# Altium project LimePSB-RPCM_1v3.PrjPcb (part 4 of 14)
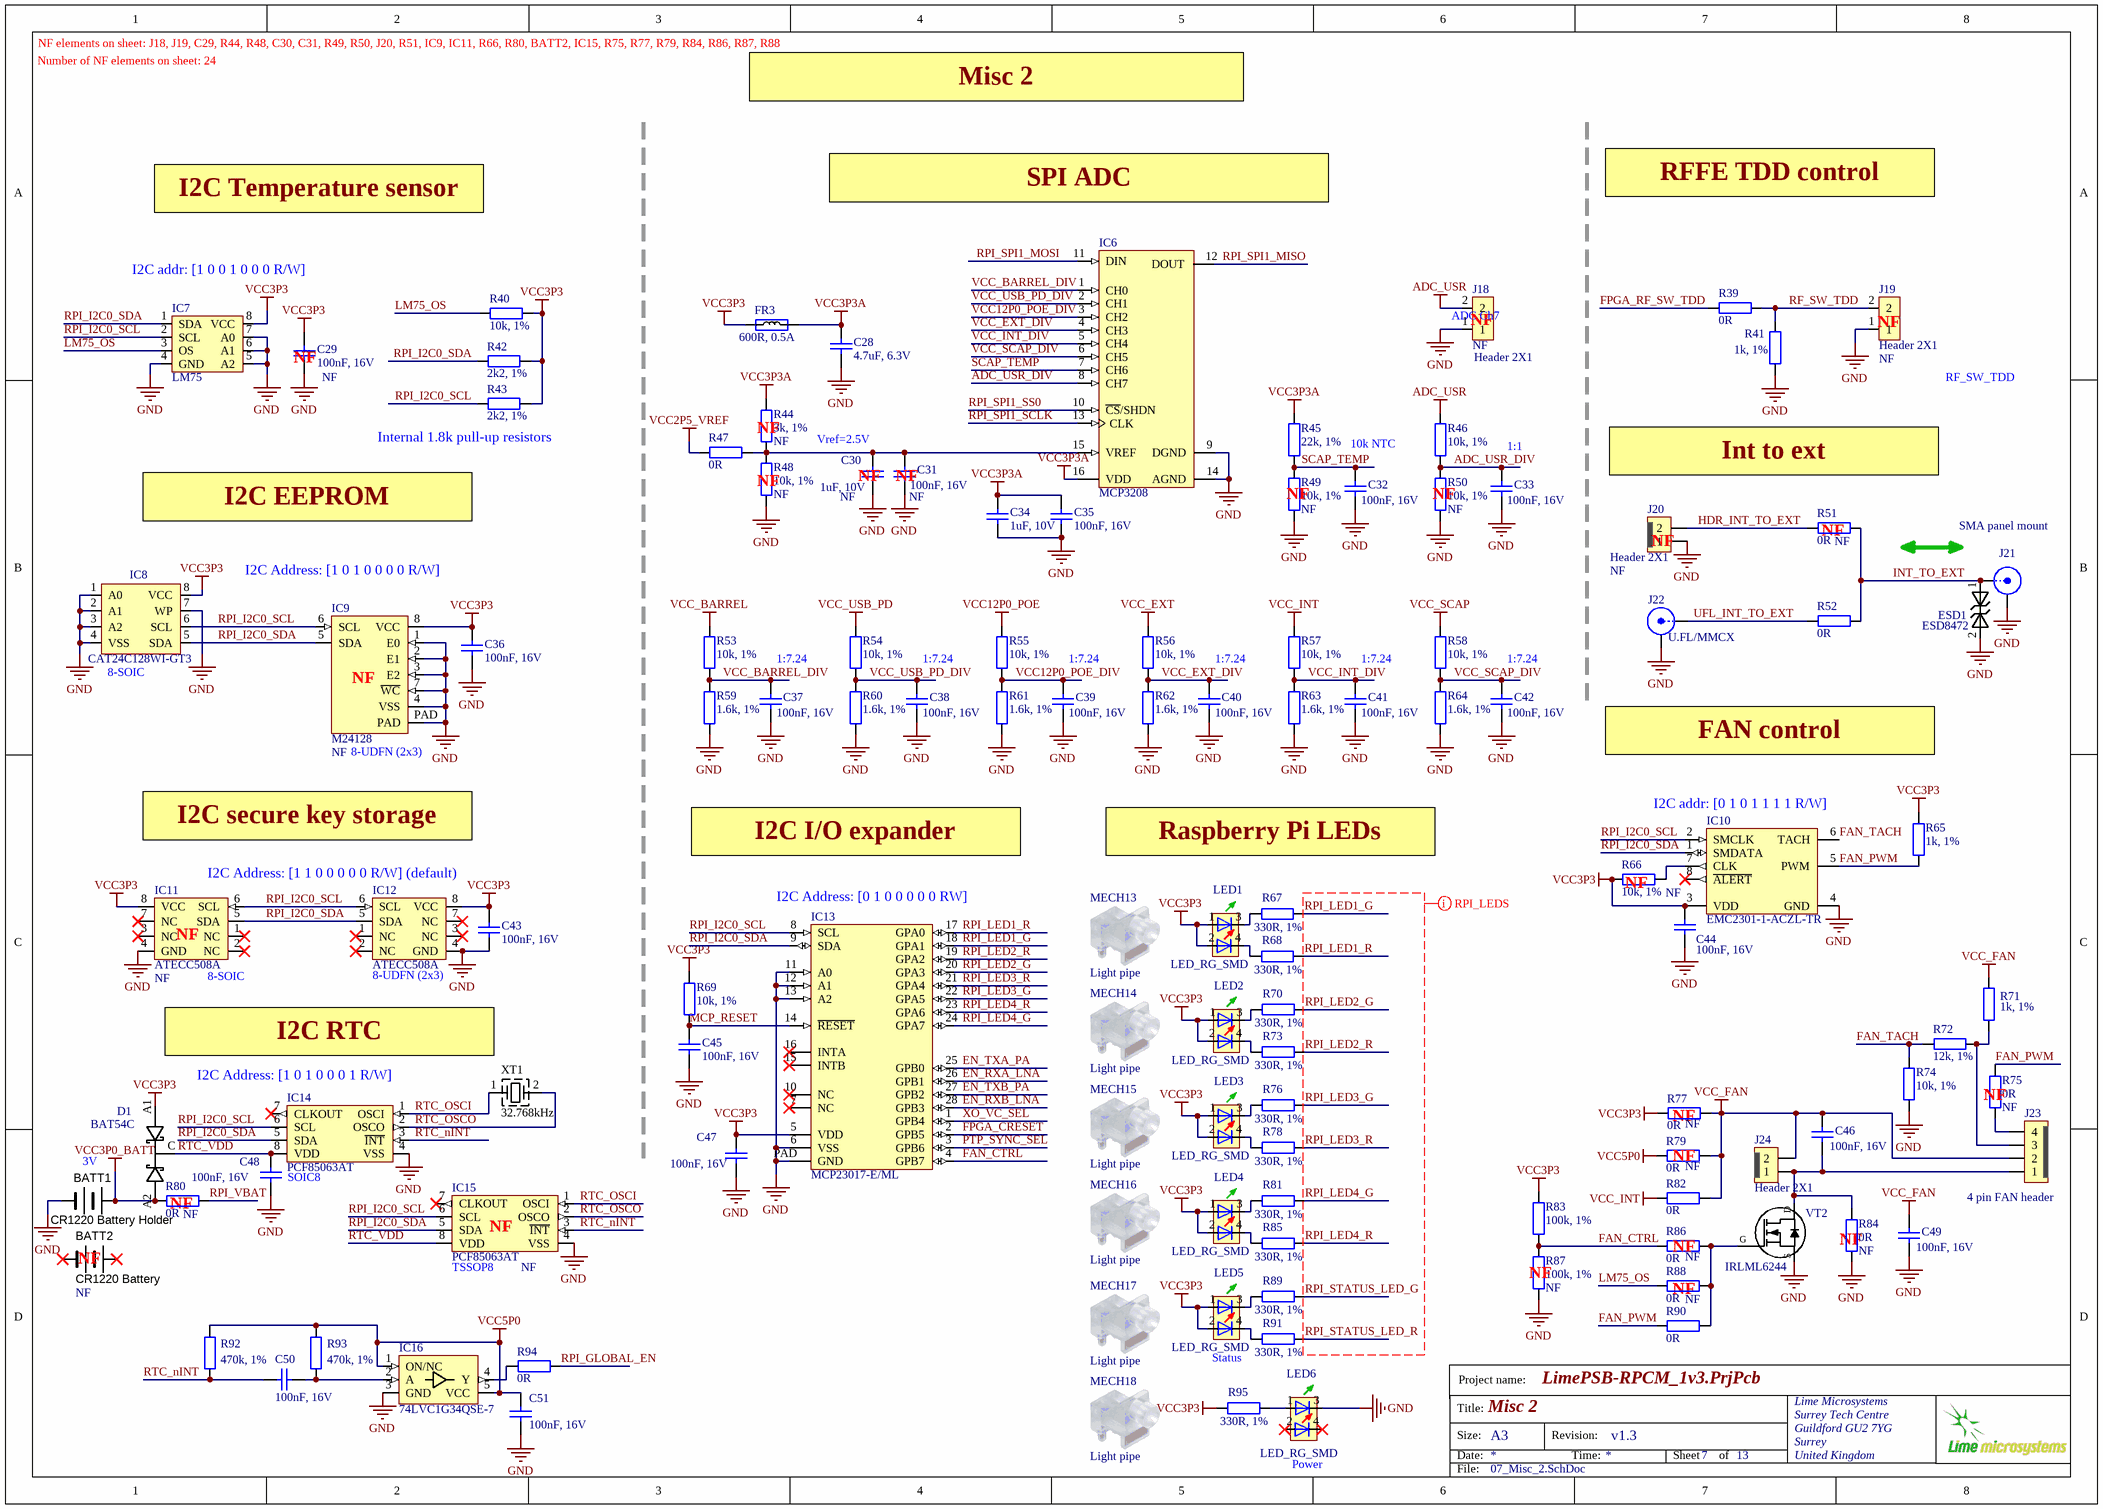
[diagram p108: 07_Misc_2.SchDoc]

## Sheet 07_Misc_2.SchDoc: Misc 2 (continued)

### Library data of the parts
BATT1 = CR1220_BATTERY_HOLDER: Part Description: HOLDER COIN CELL FOR CR1220 SMD; Manufacturer: MPD (Memory Protection Devices); Manufacturer Part Number 1: BC501SM; Battery Type, Function: Coin Cell, Holder; Style: Holder (Open); Battery Cell Size: Coin, 12.0mm; Number of Cells: 1; Battery Series: 1220; Supplier 1: Digi-Key; RoHS: RoHS Compliant; Category: Battery Products; Stock 1: 17830; Pricing 1: 1=0.88, 10=0.81, 100=0.73, 500=0.68, 1000=0.59 (USD); Part Status: Active; Mounting Type: PCB, Surface Mount; Termination Style: SMD (SMT) Tab; Height Above Board: 0.157" (4.00mm); Operating Temperature: -40°C ~ 85°C; ComponentLink1URL: http://www.memoryprotectiondevices.com/datasheets/BC501SM-datasheet.pdf; ComponentLink1Description: http://www.memoryprotectiondevices.com/datasheets/BC501SM-datasheet.pdf; Supplier Part Number 1: BC501SM-ND
BATT2 = CR1220_BATTERY: Part Description: Lithium Battery Non-Rechargeable (Primary) 3V Coin, 12.5mm; Manufacturer: Panasonic - BSG; Battery Chemistry: Lithium; Battery Cell Size: Coin, 12.5mm; Voltage - Rated: 3V; Capacity: 35mAh; Discharge Rate: 100µA; Shipping Info: Due to possible restrictions, a change in ship method may be required.; Max Air Shipment Qty: 1600; Supplier 1: Digi-Key; Manufacturer Part Number 1: CR1220; RoHS: Not Applicable; Category: Battery Products; Stock 1: 19831; Pricing 1: 1=0.9, 10=0.812, 50=0.7214, 100=0.6312, 250=0.57712, 500=0.54106, 1600=0.48153, 3200=0.44651, 5000=0.43775 (USD); Part Status: Active; Size / Dimension: 0.49" Dia x 0.08" H (12.5mm x 2.0mm); Termination Style: Requires Holder; Weight: 1.2g; ComponentLink1URL: http://na.industrial.panasonic.com/sites/default/pidsa/files/crseries_datasheets_merged.pdf; ComponentLink1Description: http://na.industrial.panasonic.com/sites/default/pidsa/files/crseries_datasheets_merged.pdf; Supplier Part Number 1: P033-ND
C28 = Cap_0402: Manufacturer: Murata Electronics North America; Manufacturer Part Number: GRM155R60J475ME87D; Part Description: 4.7µF ±20% 6.3V X5R Ceramic Capacitor -55°C ~ 85°C Surface Mount, MLCC 0402 (1005 Metric) 0.039" L x 0.020" W (1.00mm x 0.50mm); Tolerance: ±20%; Capacitance: 4.7µF; Temperature Coefficient: X5R; Lead Style: -; Ratings: -; Height - Seated (Max): -; Thickness (Max): 0.022" (0.55mm); Voltage - Rated: 6.3V; Packaging: Cut Tape (CT); Lead Spacing: -; Category: Capacitors; Supplier Part Number 1: 490-5408-1-ND; Applications: General Purpose; Operating Temperature: -55°C ~ 85°C; Mounting Type: Surface Mount, MLCC; Features: Derating Recommended; RoHS: RoHS Compliant; Supplier 1: Digi-Key; Package / Case: 0402 (1005 Metric); Size / Dimension: 0.039" L x 0.020" W (1.00mm x 0.50mm); Value: 4.7uF, 6.3V; Manufacturer Part Number 1: GRM155R60J475ME87D
C29 C31-C33 C36-C43 C45-C47 C49 = Cap_0603: Manufacturer Part Number 1: GRM155R71C104KA88D; Part Description: 0.10µF ±10% 16V Ceramic Capacitor X7R 0402 (1005 Metric); Brand: Murata Electronics; Tolerance: 10 %; Type: General Purpose MLCC; Capacitance: 0.1 uF; Temperature Coefficient / Code: +/- 15 %; Case Height: 0.5 mm; Case Length: 1 mm; Dielectric: X7R; Supplier 1: Mouser; Supplier Part Number 1: 81-GRM155R71C104KA88; Case Code - in: 0402; Manufacturer: Murata Electronics; Category: Multilayer Ceramic Capacitors MLCC - SMD/SMT; Voltage Rating DC: 16 V; Value: 100nF, 16V; Manufacturer Part Number: GRM155R71C104KA88D; Case Code - mm: 1005; Case Width: 0.5 mm; Maximum Operating Temperature: + 125 C; Minimum Operating Temperature: - 55 C; Minimum Order Quantity: 1; Operating Temperature Range: - 55 C to + 125 C; Package / Case: 0402 (1005 metric); Packaging: Reel; Product: General Type MLCCs; Product Category: Low & Medium Capacitance SMD Ceramic Chip Capacitors; Reeling: True; RoHS - Mouser: Y; RoHS: RoHS Compliant; Series: GRM; Standard Pack Qty: 10000; Termination Style: SMD/SMT
C30 = Cap_0402: CAP CER 1UF 10V X5R 0402; Manufacturer: Yageo; Part Description: 1µF 10V Ceramic Capacitor X5R 0402 (1005 Metric) 0.039" L x 0.020" W (1.00mm x 0.50mm); Manufacturer Part Number 1: CC0402MRX5R6BB105; Notification: Current market demand for these product types have resulted in fluctuating and extending lead times. Lead times may differ.; Tolerance: ±20%; Value: 1uF, 10V; Supplier 1: Digi-Key; Supplier Part Number 1: 311-1732-1-ND; RoHS: RoHS Compliant; Applications: General Purpose; Category: Capacitors; ComponentLink1Description: http://www.yageo.com/documents/recent/UPY-GPHC_X5R_4V-to-50V_25.pdf; ComponentLink1URL: http://www.yageo.com/documents/recent/UPY-GPHC_X5R_4V-to-50V_25.pdf; Failure Rate: -; Features: -; Height - Seated (Max): -; Lead Spacing: -; Lead Style: -; Mounting Type: Surface Mount, MLCC; Operating Temperature: -55°C ~ 85°C; Package / Case: 0402 (1005 Metric); Packaging: Cut Tape (CT); Part Status: Active; Pricing 1: 1=0.22, 10=0.156, 100=0.0732, 500=0.0513, 1000=0.04248, 2500=0.03953, 5000=0.03617 (USD); Ratings: -; Size / Dimension: 0.039" L x 0.020" W (1.00mm x 0.50mm); Stock 1: 69600; Temperature Coefficient: X5R; Thickness (Max): 0.022" (0.55mm); Voltage - Rated: 10V
C34 = Cap_0402: Manufacturer Part Number 1: CC0402MRX5R6BB105; Manufacturer: Yageo; Part Description: 1µF 10V Ceramic Capacitor X5R 0402 (1005 Metric) 0.039" L x 0.020" W (1.00mm x 0.50mm); Voltage Rating: 10; Capacitance Tolerance: ± 10%; Product Range: TDK - C Series; Ceramic Capacitor Case: 0402 [1005 Metric]; Capacitance: 1; Dielectric Characteristic: X6; Value: 1uF, 10V; Supplier 1: Digi-Key; Supplier Part Number 1: 311-1732-1-ND; MSL: -; RoHS: YES
C35 C44 C48 C50 C51 = Cap_0402: Manufacturer: Murata Electronics; Manufacturer Part Number: GRM155R71C104KA88D; Part Description: 0.10µF ±10% 16V Ceramic Capacitor X7R 0402 (1005 Metric); Tolerance: 10 %; Type: General Purpose MLCC; Capacitance: 0.1 uF; Case Length: 1 mm; Dielectric: X7R; Case Height: 0.5 mm; Temperature Coefficient / Code: +/- 15 %; Value: 100nF, 16V; Supplier 1: Mouser; Supplier Part Number 1: 81-GRM155R71C104KA88; Case Code - in: 0402; RoHS: RoHS Compliant; Operating Temperature Range: - 55 C to + 125 C; Series: GRM; Termination Style: SMD/SMT; Package / Case: 0402 (1005 metric); Voltage Rating DC: 16 V; Maximum Operating Temperature: + 125 C; Case Code - mm: 1005; Minimum Operating Temperature: - 55 C; Product Category: Low & Medium Capacitance SMD Ceramic Chip Capacitors; Packaging: Reel; Product: General Type MLCCs; Category: Multilayer Ceramic Capacitors MLCC - SMD/SMT; Brand: Murata Electronics; Case Width: 0.5 mm; RoHS - Mouser: Y; Standard Pack Qty: 10000; Minimum Order Quantity: 1; Reeling: True; Manufacturer Part Number 1: GRM155R71C104KA88D
D1 = BAT54C_shottky_diode: Part Description: Diode Array 1 Pair Common Cathode Schottky 30 V 200mA (DC) Surface Mount TO-236-3, SC-59, SOT-23-3; Manufacturer: Comchip; Manufacturer Part Number 1: BAT54C-G; Max Reverse Voltage (DC): 30V; Max Power Dissipation: 225mW; Average Rectified Current: 200mA; Recovery Time: 5ns; Element Configuration: Common Cathode; ComponentLink1URL: http://www.farnell.com/datasheets/1918741.pdf; ComponentLink1Description: http://www.farnell.com/datasheets/1918741.pdf; ComponentLink2URL: http://www.farnell.com/datasheets/2353871.pdf; ComponentLink2Description: http://www.farnell.com/datasheets/2353871.pdf; ComponentLink3URL: https://www.alliedelec.com/m/d/272158a697e3f24d20806a718aa29d59.pdf; ComponentLink3Description: https://www.alliedelec.com/m/d/272158a697e3f24d20806a718aa29d59.pdf; ComponentLink4URL: http://www.onsemi.com/pub/Collateral/BAT54SLT1-D.PDF; ComponentLink4Description: http://www.onsemi.com/pub/Collateral/BAT54SLT1-D.PDF; Supplier 1: Digi-Key; Supplier Part Number 1: 641-1320-1-ND; Stock 1: 764277; Pricing 1: 1=0,23000, 10=0,18500, 100=0,09830, 500=0,06468, 1000=0,04399 (USD); RoHS: Yes; Mount: Surface Mount; Case/Package: TO-236-3; Package Quantity: 1; Reverse Recovery Time: 5ns; Packaging: Tape and Reel; ComponentLink5URL: https://datasheet.ciiva.com/4717/bat54-9536-4717410.pdf?src-supplier=Mouser; ComponentLink5Description: https://datasheet.ciiva.com/4717/bat54-9536-4717410.pdf?src-supplier=Mouser; ComponentLink6URL: https://datasheet.ciiva.com/904/bat54-904630.pdf?src-supplier=Digi-Key; ComponentLink6Description: https://datasheet.ciiva.com/904/bat54-904630.pdf?src-supplier=Digi-Key; ComponentLink7URL: https://datasheet.ciiva.com/904/bat54-904631.pdf?src-supplier=Digi-Key; ComponentLink7Description: https://datasheet.ciiva.com/904/bat54-904631.pdf?src-supplier=Digi-Key; ComponentLink8URL: https://datasheet.ciiva.com/904/bat54-904632.pdf?src-supplier=Digi-Key; ComponentLink8Description: https://datasheet.ciiva.com/904/bat54-904632.pdf?src-supplier=Digi-Key
ESD1 = ESD8472: Manufacturer: ON Semiconductor; Manufacturer Part Number 1: ESD8472MUT5G; Part Description: TVS DIODE 5.3VWM 14VC X3DFN2; Voltage - Reverse Standoff (Typ): 5.3V (Max); Voltage - Breakdown (Min): 7V; Voltage - Clamping (Max) @ Ipp: 14V; Current - Peak Pulse (10/1000µs): 3A (8/20µs); Power Line Protection: No; Capacitance @ Frequency: 0.2pF @ 1MHz; Supplier 1: Digi-Key; RoHS: RoHS Compliant; Category: Circuit Protection; Stock 1: 2295; Pricing 1: 1=0.39, 10=0.315, 100=0.2142, 500=0.16068, 1000=0.12051 (USD); Packaging: Cut Tape (CT); Part Status: Active; Type: Zener; Power - Peak Pulse: -; Applications: Automotive, RF Antenna; Operating Temperature: -55°C ~ 150°C (TJ); Mounting Type: Surface Mount; Package / Case: 2-XFDFN; Supplier Device Package: 2-X3DFN (0.62x0.32); ComponentLink1URL: http://www.onsemi.com/pub/Collateral/ESD8472-D.PDF; ComponentLink1Description: http://www.onsemi.com/pub/Collateral/ESD8472-D.PDF; Supplier Part Number 1: ESD8472MUT5GOSCT-ND
FR3 = Ferrite: Manufacturer: Murata; Manufacturer Part Number 1: BLM15AX601SN1D; Part Description: - Ferrite Bead 0402 (1005 Metric) 500mA 340mOhm; Tolerance: 25%; Current Rating: 500mA; Number of Lines: 1; DC Resistance (DCR): 340mR; Test Frequency: 100MHz; Value: 600R, 0.5A; Supplier 1: Digi-Key; Supplier Part Number 1: 490-5441-1-ND; Stock 1: 416370; Pricing 1: 1=0.1, 10=0.06, 25=0.0552, 50=0.0496, 100=0.0363, 250=0.0264, 500=0.0242, 1000=0.0209, 5000=0.0165 (USD); Case/Package: 0402; Number of Pins: 2; Case Code (Metric): 1005; Case Code (Imperial): 0402; Core Material: Ferrite; Material: Steel,Ferrite; Min Operating Temperature: -55°C; Max Operating Temperature: 125°C; Package Quantity: 1; Packaging: Tape and Reel; Series: BLM15AX_SN; Impedance: 600R; Max Current Rating: 500mA; Termination: SMD/SMT; Max DC Current: 500mA; Number of Circuits: 1; DC Resistance-Max: 340mR; Length: 1mm; Width: 0.5mm; Height: 0.5mm; Depth: 0.5mm; REACH SVHC: No SVHC; Lead Free: Lead Free; RoHS Compliant: Yes; ComponentLink1URL: https://www.murata.com/en-us/products/productdata/8796740059166/ENFA0018.pdf?src-supplier=Digi-Key; ComponentLink1Description: https://www.murata.com/en-us/products/productdata/8796740059166/ENFA0018.pdf?src-supplier=Digi-Key; ComponentLink2URL: http://search.murata.co.jp/Ceramy/image/img/PDF/ENG/L0110S0100BLM15AX_SN.pdf?src-supplier=Future+Electronics; ComponentLink2Description: http://search.murata.co.jp/Ceramy/image/img/PDF/ENG/L0110S0100BLM15AX_SN.pdf?src-supplier=Future+Electronics; ComponentLink3URL: http://www.produktinfo.conrad.com/datenblaetter/1100000-1199999/001171675-da-01-en-CHIP_DROSSEL0402_600R_420MA_1_0X0_5MM.pdf?src-supplier=Conrad; ComponentLink3Description: http://www.produktinfo.conrad.com/datenblaetter/1100000-1199999/001171675-da-01-en-CHIP_DROSSEL0402_600R_420MA_1_0X0_5MM.pdf?src-supplier=Conrad; ComponentLink4URL: http://www.produktinfo.conrad.com/datenblaetter/1100000-1199999/001172169-da-01-en-DROSSEL_0402_600R_1_0X0_5MM_10000ST.pdf?src-supplier=Conrad; ComponentLink4Description: http://www.produktinfo.conrad.com/datenblaetter/1100000-1199999/001172169-da-01-en-DROSSEL_0402_600R_1_0X0_5MM_10000ST.pdf?src-supplier=Conrad
IC6 = MCP3208-CI/SL: 2.7V 4-Channel/8-Channel 12-Bit A/D Converters with SPI Serial Interface, 16-Pin SOIC 150mil, C Performance Grade, Industrial Temperature; Manufacturer: Microchip; Manufacturer Part Number 1: MCP3208T-CI/SL; Part Description: 12 Bit Analog to Digital Converter 4, 8 Input 1 SAR 16-SOIC; PackageVersion: revBB, Aug-2009; PackageReference: SOIC-SL16; PackageDescription: 16-Lead Plastic Small Outline (SL) - Narrow, 3.90mm Body [SOIC]; Supplier 1: Digi-Key; Mounting Technology: Surface Mount; PartNumber: MCP3208-CI/SL; Supplier Part Number 1: MCP3208T-CI/SLCT-ND
IC7 = LM75: Manufacturer: NXP Semiconductors; Manufacturer Part Number 1: LM75BTP,147; Part Description: SENSOR TEMPERATURE I2C 8HWSON; Sensing Temperature - Local: -55°C ~ 125°C; Output Type: I²C; Accuracy - Highest (Lowest): ±2°C (±3°C); Voltage - Supply: 2.8 V ~ 5.5 V; Test Condition: -25°C ~ 100°C (-55°C ~ 125°C); Sensor Type: Digital, Local; Resolution: 10 b; Supplier 1: Digi-Key; Operating Temperature: -55°C ~ 125°C; Features: Output Switch, Programmable Limit, Shutdown Mode; Supplier Device Package: 8-HWSON (2x3); Sensing Temperature - Remote: -; Category: Sensors, Transducers; Packaging: Tape & Reel (TR); RoHS: RoHS Compliant; Package / Case: 8-WFDFN Exposed Pad; Supplier Part Number 1: 568-9815-2-ND
IC8 = 24FC64F: Part Description: EEPROM Memory IC 128Kb (16K x 8) I²C 1MHz 400ns 8-SOIC; Manufacturer: ON Semiconductor; Memory Type: Non-Volatile; Memory Format: EEPROM; Memory Size: 128Kb (16K x 8); Write Cycle Time - Word, Page: 5ms; Memory Interface: I²C; Voltage - Supply: 1.8 V ~ 5.5 V; Supplier 1: Digi-Key; Supplier Part Number 1: CAT24C128WI-GT3CT-ND; Manufacturer Part Number 1: CAT24C128WI-GT3; RoHS: RoHS Compliant; Category: Integrated Circuits (ICs); Stock 1: 14804; Pricing 1: 1=0.31, 10=0.309, 100=0.2532, 500=0.24616, 1000=0.23956 (USD); Packaging: Cut Tape (CT); Part Status: Active; Technology: EEPROM; Operating Temperature: -40°C ~ 85°C (TA); Mounting Type: Surface Mount; Package / Case: 8-SOIC (0.154", 3.90mm Width); Supplier Device Package: 8-SOIC; Base Part Number: CAT24C128; ComponentLink1URL: http://www.onsemi.com/pub/Collateral/CAT24C128-D.PDF; ComponentLink1Description: http://www.onsemi.com/pub/Collateral/CAT24C128-D.PDF
IC9 = M24128-DFMC6TG: Manufacturer: STMicroelectronics; Part Description: EEPROM Memory IC 128Kb (16K x 8) I²C 1MHz 450ns 8-UFDFPN (2x3); Memory Type: Non-Volatile; Memory Format: EEPROM; Memory Size: 128Kb (16K x 8); Write Cycle Time - Word, Page: 5ms; Memory Interface: I²C; Voltage - Supply: 1.7 V ~ 5.5 V; Supplier 1: Digi-Key; Manufacturer Part Number 1: M24128-DFMC6TG; RoHS: RoHS Compliant; Category: Integrated Circuits (ICs); Stock 1: 5894; Pricing 1: 1=0.35, 10=0.348, 100=0.2854, 500=0.27748, 1000=0.27004 (USD); Packaging: Cut Tape (CT); Part Status: Active; Technology: EEPROM; Operating Temperature: -40°C ~ 85°C (TA); Mounting Type: Surface Mount; Package / Case: 8-UFDFN Exposed Pad; Supplier Device Package: 8-UFDFPN (2x3); ComponentLink1URL: http://www.st.com/content/ccc/resource/technical/document/datasheet/59/05/c9/5b/7b/41/48/b6/CD00259167.pdf/files/CD00259167.pdf/jcr:content/translations/en.CD00259167.pdf; ComponentLink1Description: http://www.st.com/content/ccc/resource/technical/document/datasheet/59/05/c9/5b/7b/41/48/b6/CD00259167.pdf/files/CD00259167.pdf/jcr:content/translations/en.CD00259167.pdf; Supplier Part Number 1: 497-15739-1-ND
IC10 = EMC2301-1-ACZL-TR_MOTOR_DRIVER: Part Description: IC MOTOR DRIVER 3V-3.6V 8MSOP; Manufacturer: Microchip; Operating Supply Voltage: 3.3V; Min Supply Voltage: 3V; Max Supply Voltage: 3.6V; Interface: I2C,SMBus,2-Wire,PWM; Operating Supply Current: 350uA; Output Type: Digital; Supplier 1: Digikey; Supplier Part Number 1: EMC2301-1-ACZL-CT-ND; Manufacturer Part Number 1: EMC2301-1-ACZL-TR; Stock 1: 45372; Pricing 1: 1=1,23, 25=1,03, 100=0,9875 (USD); RoHS: Yes; Mount: Surface Mount; Case/Package: MSOP; Number of Pins: 8; Min Operating Temperature: -40°C; Max Operating Temperature: 125°C; Packaging: Tape and Reel; Max Supply Voltage (DC): 3.6V; Min Supply Voltage (DC): 3V; Series: -; Lead Free: Lead Free; ComponentLink1URL: https://datasheet.ciiva.com/29573/2301-29573777.pdf?src-supplier=Digikey; ComponentLink1Description: https://datasheet.ciiva.com/29573/2301-29573777.pdf?src-supplier=Digikey; ComponentLink2URL: https://datasheet.ciiva.com/48437/2301-48437622.pdf?src-supplier=Avnet; ComponentLink2Description: https://datasheet.ciiva.com/48437/2301-48437622.pdf?src-supplier=Avnet
IC11 = ATECC508A_authentication_IC: Manufacturer: Microchip Technology; Manufacturer Part Number 1: ATECC508A-SSHDA-T; Part Description: Authentication Chip IC Networking and Communications 8-SOIC; Type: Authentication Chip; Mounting Type: Surface Mount; Supplier Part Number 1: ATECC508A-SSHDA-TCT-ND; Applications: Networking and Communications; Category: Integrated Circuits (ICs); Supplier 1: Digi-Key; Base Part Number: ATECC508; RoHS: RoHS Compliant; Package / Case: 8-SOIC (0.154", 3.90mm Width); Packaging: Cut Tape (CT); Supplier Device Package: 8-SOIC; Part Status: Active
IC12 = ATECC508A_authentication_IC: Manufacturer: Microchip; Manufacturer Part Number 1: ATECC508A-MAHDA-S; Part Description: Authentication Chip IC Networking and Communications 8-UDFN (2x3); Supplier 1: Digi-Key; Stock 1: 27941; Pricing 1: 1=0.73, 25=0.7064 (USD); Supplier Part Number 1: ATECC508A-MAHDA-SDKR-ND
IC13 = MCP23017-E/ML_I2C_expander: Part Description: I/O Expander 16 I²C 1.7 MHz 28-QFN (6x6); Manufacturer: Microchip; ComponentLink1URL: https://datasheet.ciiva.com/1496/12179-1496011.pdf?src-supplier=Element14; ComponentLink1Description: https://datasheet.ciiva.com/1496/12179-1496011.pdf?src-supplier=Element14; ComponentLink2URL: https://datasheet.ciiva.com/1780/21952b-1780121.pdf?src-supplier=Digi-Key; ComponentLink2Description: https://datasheet.ciiva.com/1780/21952b-1780121.pdf?src-supplier=Digi-Key; ComponentLink3URL: https://datasheet.ciiva.com/3149/21952b-3149158.pdf?src-supplier=Avnet; ComponentLink3Description: https://datasheet.ciiva.com/3149/21952b-3149158.pdf?src-supplier=Avnet; ComponentLink4URL: https://datasheet.ciiva.com/16222/filehandler-aspxddocname-en023709-16222331.pdf?src-supplier=Future+Electronics; ComponentLink4Description: https://datasheet.ciiva.com/16222/filehandler-aspxddocname-en023709-16222331.pdf?src-supplier=Future+Electronics; Supplier 1: Digi-Key; Supplier Part Number 1: MCP23017-E/ML-ND; Manufacturer Part Number 1: MCP23017-E/ML; Stock 1: 3965; Pricing 1: 1=1,9, 25=1,59, 100=1,44 (USD); RoHS: Yes
IC14 = PCF85063AT_RTC_CALENDAR: Part Description: IC RTC CLOCK/CALENDAR I2C 8SO; Manufacturer: NXP Semiconductors; Manufacturer Part Number 1: PCF85063AT/AY; Interface: I2C,Serial,2-Wire; Logic Function: Clock; Time Format: HH:MM:SS (12/24 hr); Date Format: YY-MM-DD-dd; ComponentLink1URL: http://www.farnell.com/datasheets/2014362.pdf?src-supplier=Farnell; ComponentLink1Description: http://www.farnell.com/datasheets/2014362.pdf?src-supplier=Farnell; ComponentLink2URL: https://www.nxp.com/docs/en/data-sheet/PCF85063A.pdf?src-supplier=Digi-Key; ComponentLink2Description: https://www.nxp.com/docs/en/data-sheet/PCF85063A.pdf?src-supplier=Digi-Key; ComponentLink3URL: http://www.nxp.com/documents/data_sheet/PCF85063A.pdf?src-supplier=Avnet; ComponentLink3Description: http://www.nxp.com/documents/data_sheet/PCF85063A.pdf?src-supplier=Avnet; Supplier 1: Digi-Key; Supplier Part Number 1: 568-12403-1-ND; Stock 1: 6716; Pricing 1: 1=1,05000, 10=0,93800, 25=0,89040, 100=0,73150, 250=0,68380, 500=0,60428, 1000=0,47707 (USD); RoHS: Yes; Mount: Surface Mount; Case/Package: SOIC; Number of Pins: 8; Min Operating Temperature: -40°C; Max Operating Temperature: 85°C; Packaging: Tape and Reel; Radiation Hardening: No; Lead Free: Lead Free; RoHS Compliant: Yes; ComponentLink4URL: https://datasheet.ciiva.com/48465/pcf85063a-48465101.pdf?src-supplier=Avnet; ComponentLink4Description: https://datasheet.ciiva.com/48465/pcf85063a-48465101.pdf?src-supplier=Avnet
IC15 = PCF85063AT_RTC_CALENDAR: Part Description: Real Time Clock (RTC) IC Clock/Calendar - I²C, 2-Wire Serial 8-SOIC (0.154", 3.90mm Width); Manufacturer: NXP Semiconductors; Manufacturer Part Number: PCF85063ATT/AJ; Interface: I2C,Serial,2-Wire; Time Format: HH:MM:SS (12/24 hr); Date Format: YY-MM-DD-dd; Logic Function: Clock; Max Supply Voltage: 5.5V; Min Supply Voltage: 900mV; Supplier 1: Digi-Key; Supplier Part Number 1: 568-12404-1-ND; Stock 1: 56211; Pricing 1: 1=1,06000, 10=0,94800, 25=0,89920, 100=0,73870, 250=0,69056, 500=0,61028, 1000=0,50779 (USD); RoHS: Yes; Mount: Surface Mount; Case/Package: TSSOP; Number of Pins: 8; Contact Plating: Gold; Min Operating Temperature: -40°C; Max Operating Temperature: 85°C; Packaging: Tape and Reel; RoHS Compliant: Yes; Lead Free: Lead Free; ComponentLink1URL: http://www.farnell.com/datasheets/2014362.pdf?src-supplier=Farnell; ComponentLink1Description: http://www.farnell.com/datasheets/2014362.pdf?src-supplier=Farnell; ComponentLink2URL: https://www.nxp.com/docs/en/data-sheet/PCF85063A.pdf?src-supplier=Digi-Key; ComponentLink2Description: https://www.nxp.com/docs/en/data-sheet/PCF85063A.pdf?src-supplier=Digi-Key; ComponentLink3URL: http://www.nxp.com/documents/data_sheet/PCF85063A.pdf?src-supplier=Avnet; ComponentLink3Description: http://www.nxp.com/documents/data_sheet/PCF85063A.pdf?src-supplier=Avnet; Manufacturer Part Number 1: PCF85063ATT/AJ
IC16 = 74AHCT1G126SE-7_BUFFER_NON_INV: Part Description: Buffers & Line Drivers Logic LVC 1 Gate SOT353 T&R 3K; Manufacturer: Diodes; ComponentLink1URL: https://datasheet.ciiva.com/12256/74ahct1g126-80154-12256741.pdf?src-supplier=Mouser; ComponentLink1Description: https://datasheet.ciiva.com/12256/74ahct1g126-80154-12256741.pdf?src-supplier=Mouser; ComponentLink2URL: https://datasheet.ciiva.com/26949/getdatasheetpartid-792439-26949318.pdf?src-supplier=Verical; ComponentLink2Description: https://datasheet.ciiva.com/26949/getdatasheetpartid-792439-26949318.pdf?src-supplier=Verical; ComponentLink3URL: https://datasheet.ciiva.com/1832/74ahct1g126-1832523.pdf?src-supplier=Digi-Key; ComponentLink3Description: https://datasheet.ciiva.com/1832/74ahct1g126-1832523.pdf?src-supplier=Digi-Key; ComponentLink4URL: https://datasheet.ciiva.com/1832/74ahct1g126-1832524.pdf?src-supplier=Digi-Key; ComponentLink4Description: https://datasheet.ciiva.com/1832/74ahct1g126-1832524.pdf?src-supplier=Digi-Key; ComponentLink5URL: https://datasheet.ciiva.com/1154/74ahct1g126-1154309.pdf?src-supplier=Element14; ComponentLink5Description: https://datasheet.ciiva.com/1154/74ahct1g126-1154309.pdf?src-supplier=Element14; ComponentLink6URL: https://datasheet.ciiva.com/26939/getdatasheetpartid-779272-26939183.pdf?src-supplier=Verical; ComponentLink6Description: https://datasheet.ciiva.com/26939/getdatasheetpartid-779272-26939183.pdf?src-supplier=Verical; Supplier 1: Mouser; Supplier Part Number 1: 621-74LVC1G34QSE-7; Manufacturer Part Number 1: 74LVC1G34QSE-7; Stock 1: 1171; Pricing 1: 1=0,45000, 10=0,33900, 50=0,33900, 100=0,17800, 1000=0,11200, 10000=0,09400 (USD); RoHS: Yes
J18 J19 = Jumper: Manufacturer Part Number 1: 961102-6404-AR; Part Description: 2 Positions Header, Unshrouded Connector 0.100" (2.54mm) Through Hole Gold; Manufacturer: 3M; Connector Type: Header, Unshrouded; Supplier 1: Digi-Key; Supplier Part Number 1: 3M9447-ND; Contact Type: Male Pin; Color: Black; Mounting Type: Through Hole; Category: Connectors, Interconnects; Contact Finish: Gold
J20 J24 = Header 2X1 LOCK: Manufacturer 1: Molex; Part Description: Connector Header Through Hole 2 position 0.100" (2.54mm); Supplier 1: Digi-Key; Supplier Part Number 1: WM19460-ND; Manufacturer Part Number: 22-11-2026; Stock 1: 0; RoHS: Yes; ComponentLink1URL: https://datasheet.ciiva.com/5156/022045042-sd-206842-5156139.pdf?src-supplier=Mouser; ComponentLink1Description: https://datasheet.ciiva.com/5156/022045042-sd-206842-5156139.pdf?src-supplier=Mouser; ComponentLink2URL: https://datasheet.ciiva.com/30212/022232051-sd-30212109.pdf?src-supplier=Onlinecomponents.com; ComponentLink2Description: https://datasheet.ciiva.com/30212/022232051-sd-30212109.pdf?src-supplier=Onlinecomponents.com; Manufacturer: Molex; Manufacturer Part Number 1: 22-11-2026
J21 = RF_IF_connector: CONN SMA JACK STR 50OHM EDGE MNT; Manufacturer: Linx; Manufacturer Part Number 1: CONSMA002-L-G; Part Description: SMA Connector Receptacle, Female Socket 50Ohm Panel Mount, Through Hole, Right Angle Solder; Supplier 1: Digi-Key; Supplier Part Number 1: CONSMA002-L-G-ND; Stock 1: 815; Pricing 1: 1=4.08, 25=3.67, 100=3.32, 250=3.25, 500=3, 1000=2.80001, 2000=2.5875 (USD)
J22 = RF_IF_connector: CONN UMC RCPT STR 50 OHM SMD; Manufacturer: Molex, LLC; Manufacturer Part Number 1: 0734120110; Body Finish: Nickel; Body Material: Phosphor Bronze; Center Contact Material: Brass; Center Contact Plating: Gold; Connector Style: Ultra Miniature Coaxial; Connector Type: Jack, Male Pin; Contact Termination: Solder; Dielectric Material: Liquid Crystal Polymer (LCP); Frequency - Max: 6GHz; Impedance: 50 Ohm; Voltage Rating: 60V; Cable Group: -; Category: Connectors, Interconnects; Fastening Type: Snap-On; Features: -; Housing Color: Silver; Ingress Protection: -; Mounting Type: Surface Mount; Operating Temperature: -40°C ~ 90°C; Packaging: Cut Tape (CT); RoHS: RoHS Compliant; Shield Termination: Solder; Supplier 1: Digi-Key; Supplier Part Number 1: WM5587CT-ND; Part Description: CONN UMC RCPT STR 50 OHM SMD
J23 = Header 4X1 LOCK: Manufacturer 1: Molex; Manufacturer Part Number 1: 47053-1000; Part Description: Connector Header Through Hole 4 position 0.100" (2.54mm); Supplier 1: Digi-Key; Supplier Part Number 1: WM4330-ND; Stock 1: 76671; Pricing 1: 1=0,56000, 10=0,47100, 100=0,36650, 1000=0,28797, 5000=0,25307, 10000=0,23561 (USD); RoHS: Yes; ComponentLink1URL: https://datasheet.ciiva.com/22683/1701278-22683428.pdf?src-supplier=Element14; ComponentLink1Description: https://datasheet.ciiva.com/22683/1701278-22683428.pdf?src-supplier=Element14; ComponentLink2URL: https://datasheet.ciiva.com/30226/191140470531000-pcb-headers-30226282.pdf?src-supplier=Onlinecomponents.com; ComponentLink2Description: https://datasheet.ciiva.com/30226/191140470531000-pcb-headers-30226282.pdf?src-supplier=Onlinecomponents.com; ComponentLink3URL: https://datasheet.ciiva.com/5153/0470531000-pcb-headers-146351-5153461.pdf?src-supplier=Mouser; ComponentLink3Description: https://datasheet.ciiva.com/5153/0470531000-pcb-headers-146351-5153461.pdf?src-supplier=Mouser; ComponentLink4URL: https://datasheet.ciiva.com/10090/0470531000-pcb-headers-10090525.pdf?src-supplier=Avnet; ComponentLink4Description: https://datasheet.ciiva.com/10090/0470531000-pcb-headers-10090525.pdf?src-supplier=Avnet; Manufacturer: Molex
LED1-LED6 = LED_green_red_SMD: Manufacturer Part Number 1: HSMF-C165; Manufacturer: Avago Technologies US Inc.; Part Description: LED GREEN/RED DIFFUSED 0603 SMD; Millicandela Rating: 15mcd Green, 10mcd Red; Lens Transparency: Diffused; Lens Color: White; Lens Style/Size: Rectangle with Flat Top, 1.60mm x 0.80mm; Wavelength - Peak: 570nm Green, 636nm Red; Wavelength - Dominant: 572nm Green, 621nm Red; Viewing Angle: 120°; Voltage - Forward (Vf) (Typ): 2.2V Green, 1.95V Red; Current - Test: 20mA; Color: Green, Red; Supplier 1: Digi-Key; Height (Max): 0.50mm; Packaging: Cut Tape (CT); Category: Optoelectronics; Mounting Type: Surface Mount; Package / Case: 0603 (1608 Metric); Size / Dimension: 1.60mm L x 0.80mm W; Supplier Device Package: *; RoHS: RoHS Compliant; Supplier Part Number 1: 516-1419-1-ND
MECH13-MECH18 = LIGHT_PIPE_RIGHT_ANGLE_SLP3-200-100-F: Part Description: Light Pipe Single Clear Rigid Board Mount, Press Fit, Right Angle; Manufacturer: Bivar; Supplier 1: Digi-Key; Supplier Part Number 1: 492-1865-ND; Manufacturer Part Number 1: SLP3-200-100-F; Stock 1: 11458; Pricing 1: 1=0,70000, 10=0,45900, 100=0,30340, 1000=0,23424, 2000=0,21167, 5000=0,19755, 10000=0,19050, 25000=0,18768 (USD); RoHS: Yes; ComponentLink1URL: https://datasheet.ciiva.com/1535/1760190-1535004.pdf?src-supplier=Element14; ComponentLink1Description: https://datasheet.ciiva.com/1535/1760190-1535004.pdf?src-supplier=Element14; ComponentLink2URL: https://datasheet.ciiva.com/48976/70536303-48976693.pdf?src-supplier=Allied+Electronics; ComponentLink2Description: https://datasheet.ciiva.com/48976/70536303-48976693.pdf?src-supplier=Allied+Electronics; ComponentLink3URL: https://datasheet.ciiva.com/18526/slp3-xxx-xxx-x-18526910.pdf?src-supplier=Digi-Key; ComponentLink3Description: https://datasheet.ciiva.com/18526/slp3-xxx-xxx-x-18526910.pdf?src-supplier=Digi-Key
R39 R94 = Res_0402: Manufacturer: Yageo; Part Description: RES SMD 0.0OHM JUMPER 1/16W 0402; Manufacturer Part Number 1: RC0402JR-070RL; Power (Watts): 0.063W, 1/16W; Resistance (Ohms): 0.0; Tolerance: Jumper; Supplier 1: Digi-Key; Supplier Part Number 1: 311-0.0JRTR-ND; Composition: Thick Film; Package / Case: 0402 (1005 Metric); Category: Resistors; Value: 0R; Features: Moisture Resistant; Height: 0.016" (0.40mm); Number of Terminations: 2; Operating Temperature: -55°C ~ 155°C; Packaging: Tape & Reel (TR); RoHS: RoHS Compliant; Size / Dimension: 0.039" L x 0.020" W (1.00mm x 0.50mm); Supplier Device Package: 0402; Temperature Coefficient: -
R40 R46 R48-R50 R53-R58 R66 R69 R74 = Res_0402: Manufacturer: Yageo; Manufacturer Part Number 1: RC0402FR-0710KL; Part Description: RES SMD 10K OHM 1% 1/16W 0402; Temperature Coefficient: ±100ppm/°C; Power (Watts): 0.063W, 1/16W; Value: 10k, 1%; Supplier 1: Digi-Key; Supplier Part Number 1: 311-10.0KLRTR-ND; Resistance (Ohms): 10k; Packaging: Tape & Reel (TR); RoHS: RoHS Compliant; Package / Case: 0402 (1005 Metric); Tolerance: ±1%; Operating Temperature: -55°C ~ 155°C; Size / Dimension: 0.039" L x 0.020" W (1.00mm x 0.50mm); Number of Terminations: 2; Category: Resistors; Height: 0.016" (0.40mm); Supplier Device Package: 0402; Features: Moisture Resistant; Composition: Thick Film
R41 R65 R71 = Res_0402: Manufacturer: Stackpole Electronics Inc; Manufacturer Part Number 1: RMCF0402FT1K00; Part Description: RES SMD 1K OHM 1% 1/16W 0402; Temperature Coefficient: ±100ppm/°C; Power (Watts): 0.063W, 1/16W; Value: 1k, 1%; Supplier 1: Digi-Key; Supplier Part Number 1: RMCF0402FT1K00TR-ND; Package / Case: 0402 (1005 Metric); Supplier Device Package: 0402; Height: 0.016" (0.40mm); Size / Dimension: 0.039" L x 0.020" W (1.00mm x 0.50mm); Number of Terminations: 2; Packaging: Cut Tape (CT); Category: Resistors; Composition: Thick Film; Resistance (Ohms): 1k; Tolerance: ±1%; Features: Moisture Resistant; Operating Temperature: -55°C ~ 155°C; RoHS: RoHS Compliant
R42 R43 = Res_0402: Manufacturer: Stackpole Electronics Inc; Manufacturer Part Number 1: RMCF0402FT2K20; Part Description: RES SMD 2.2K OHM 1% 1/16W 0402; Resistance (Ohms): 2.2k; Temperature Coefficient: ±100ppm/°C; Power (Watts): 0.063W, 1/16W; Value: 2k2, 1%; Supplier 1: Digi-Key; Supplier Part Number 1: RMCF0402FT2K20CT-ND; Supplier Device Package: 0402; Package / Case: 0402 (1005 Metric); Size / Dimension: 0.039" L x 0.020" W (1.00mm x 0.50mm); Operating Temperature: -55°C ~ 155°C; Composition: Thick Film; Category: Resistors; Features: -; Height: 0.016" (0.40mm); RoHS: RoHS Compliant; Number of Terminations: 2; Packaging: Cut Tape (CT); Tolerance: ±1%
R44 = Res_0402: Manufacturer: Vishay Dale; Part Description: RES SMD 3K OHM 1% 1/16W 0402; Manufacturer Part Number 1: CRCW04023K00FKED; Temperature Coefficient: ±100ppm/°C; Power (Watts): 0.063W, 1/16W; Value: 3k, 1%; Category: Resistors; Tolerance: ±1%; RoHS: RoHS Compliant; Composition: Thick Film; Number of Terminations: 2; Operating Temperature: -55°C ~ 155°C; Supplier Device Package: 0402 (1005 Metric); Supplier Part Number 1: 541-3.00KLCT-ND; Packaging: Cut Tape (CT); Supplier 1: Digi-Key; Package / Case: 0402 (1005 Metric); Features: Automotive AEC-Q200; Resistance (Ohms): 3k; Height: 0.016" (0.40mm); Size / Dimension: 0.039" L x 0.020" W (1.00mm x 0.50mm)
R45 = Res_0402: Manufacturer: Yageo; Part Description: RES SMD 22K OHM 1% 1/16W 0402; Manufacturer Part Number 1: RC0402FR-0722KL; Temperature Coefficient: ±100ppm/°C; Power (Watts): 0.063W, 1/16W; Value: 22k, 1%; Number of Terminations: 2; Operating Temperature: -55°C ~ 155°C; Package / Case: 0402 (1005 Metric); Category: Resistors; Size / Dimension: 0.039" L x 0.020" W (1.00mm x 0.50mm); Height: 0.016" (0.40mm); Supplier 1: Digi-Key; Supplier Part Number 1: 311-22.0KLRCT-ND; RoHS: RoHS Compliant; Features: Moisture Resistant; Packaging: Cut Tape (CT); Composition: Thick Film; Supplier Device Package: 0402; Resistance (Ohms): 22k; Tolerance: ±1%
R47 R51 R52 R75 R77 R79 R80 R82 R84 R86 R88 R90 = Res_0402: Manufacturer Part Number 1: RC0402JR-070RL; Manufacturer: Yageo; Part Description: RES SMD 0.0OHM JUMPER 1/16W 0402; Resistance (Ohms): 0.0; Tolerance: Jumper; Power (Watts): 0.063W, 1/16W; Value: 0R; Supplier 1: Digi-Key; Supplier Part Number 1: 311-0.0JRTR-ND; Category: Resistors; Temperature Coefficient: -; Features: Moisture Resistant; Supplier Device Package: 0402; Height: 0.016" (0.40mm); Package / Case: 0402 (1005 Metric); Operating Temperature: -55°C ~ 155°C; Size / Dimension: 0.039" L x 0.020" W (1.00mm x 0.50mm); Composition: Thick Film; Packaging: Tape & Reel (TR); Number of Terminations: 2; RoHS: RoHS Compliant
R59-R64 = Res_0402: Manufacturer Part Number 1: RC0402FR-071K6L; Manufacturer: Yageo; Part Description: 1.6 kOhms ±1% 0.063W, 1/16W Chip Resistor 0402 (1005 Metric) Moisture Resistant Thick Film; Temperature Coefficient: ±100ppm/°C; Power (Watts): 0.063W, 1/16W; Value: 1.6k, 1%; Tolerance: ±1%; RoHS: RoHS Compliant; Package / Case: 0402 (1005 Metric); Height - Seated (Max): 0.016" (0.40mm); Supplier Device Package: 0402; Failure Rate: -; Composition: Thick Film; Part Status: Active; Size / Dimension: 0.039" L x 0.020" W (1.00mm x 0.50mm); Operating Temperature: -55°C ~ 155°C; Packaging: Cut Tape (CT); Features: Moisture Resistant; Supplier Part Number 1: YAG3045CT-ND; Category: Resistors; Supplier 1: Digi-Key
R67 R68 R70 R73 R76 R78 R81 R85 R89 R91 R95 = Res_0402: Manufacturer: Yageo; Manufacturer Part Number 1: RC0402FR-07330RL; Part Description: 330 Ohms ±1% 0.063W, 1/16W Chip Resistor 0402 (1005 Metric) Moisture Resistant Thick Film; Max Power Dissipation: 63mW; Power Rating: 62.5mW; Temperature Coefficient: 100ppm/°C; Voltage Rating: 50V; Case/Package: 0402; Case Code (Imperial): 0402; Case Code (Metric): 1005; ComponentLink1Description: http://www.farnell.com/datasheets/2167052.pdf?src-supplier=Farnell; ComponentLink1URL: http://www.farnell.com/datasheets/2167052.pdf?src-supplier=Farnell; ComponentLink2Description: http://www.farnell.com/datasheets/2167052.pdf?src-supplier=Newark; ComponentLink2URL: http://www.farnell.com/datasheets/2167052.pdf?src-supplier=Newark; ComponentLink3Description: http://www.farnell.com/datasheets/1018594.pdf?src-supplier=Element14; ComponentLink3URL: http://www.farnell.com/datasheets/1018594.pdf?src-supplier=Element14; Construction: Rectangular; Depth: 0.5mm; Features: Moisture Resistant; Height: 0.016inch; Lead Free: Lead Free; Length: 0.039inch; Max Operating Temperature: 155°C; Military Standard: Not; Min Operating Temperature: -55°C; Number of Terminations: 2; Package Quantity: 1; Packaging: Tape and Reel; Pricing 1: 1=0,10000, 10=0,01500, 100=0,00610, 1000=0,00275, 2500=0,00239, 5000=0,00197 (USD); REACH SVHC: Unknown; Resistance: 330R; Resistance Tolerance: 1%; Resistor Type: Thick Film; RoHS: Yes; RoHS Compliant: Yes; Series: RC; Size Code: 0402; Stock 1: 7298585; Supplier 1: Digi-Key; Supplier Part Number 1: 311-330LRCT-ND; Technology: THICK FILM; Termination: SMD/SMT; Tolerance: 1%; Value: 330R, 1%; Width: 0.02inch
R72 = Res_0402: Manufacturer: Samsung Electro-Mechanics; Manufacturer Part Number 1: RC1005F123CS; Part Description: 12 kOhms ±1% 0.063W, 1/16W Chip Resistor 0402 (1005 Metric) Moisture Resistant Thick Film; Power (Watts): 0.063W, 1/16W; Temperature Coefficient: ±100ppm/°C; Value: 12k, 1%; Operating Temperature: -55°C ~ 155°C; Height - Seated (Max): 0.016" (0.40mm); Supplier 1: Digi-Key; Packaging: Cut Tape (CT); Composition: Thick Film; Tolerance: ±1%; Category: Resistors; Part Status: Active; Failure Rate: -; Supplier Device Package: 0402; Features: Moisture Resistant; Supplier Part Number 1: 1276-4122-1-ND; RoHS: RoHS Compliant; Package / Case: 0402 (1005 Metric); Size / Dimension: 0.039" L x 0.020" W (1.00mm x 0.50mm)
R83 R87 = Res_0402: Part Description: 100 kOhms ±1% 0.063W, 1/16W Chip Resistor 0402 (1005 Metric) Thick Film; Manufacturer: Vishay; Manufacturer Part Number 1: CRCW0402100KFKEDC; Power Rating: 62.5mW; Resistance: 100kR; Temperature Coefficient: 100ppm/°C; Value: 100k, 1%; Supplier 1: Digi-Key; Supplier Part Number 1: 541-3960-6-ND; Stock 1: 702107; Pricing 1: 1=0,10000, 10=0,03300, 100=0,01360, 1000=0,00610, 2500=0,00529, 5000=0,00437 (USD); RoHS: Yes; Mount: Surface Mount; Case/Package: SMD/SMT; Contact Plating: Tin; Min Operating Temperature: -55°C; Max Operating Temperature: 155°C; Tolerance: 1%; Resistor Type: Thick Film; Termination: Wraparound; Length: 1mm; Lead Free: Lead Free; RoHS Compliant: Yes; ComponentLink1URL: http://www.vishay.com/docs/28773/crcwce3.pdf?src-supplier=Digi-Key; ComponentLink1Description: http://www.vishay.com/docs/28773/crcwce3.pdf?src-supplier=Digi-Key
R92 R93 = Res_0402: Manufacturer: TE Connectivity; Manufacturer Part Number 1: CRGCQ0402F470K; Part Description: 470 kOhms ±1% 0.063W, 1/16W Chip Resistor 0402 (1005 Metric) Automotive AEC-Q200, Moisture Resistant Thick Film; ComponentLink1URL: http://www.yageo.com/documents/recent/PYu-RC_Group_51_RoHS_L_9.pdf; ComponentLink1Description: http://www.yageo.com/documents/recent/PYu-RC_Group_51_RoHS_L_9.pdf; ComponentLink2URL: http://www.yageo.com/documents/recent/PYu-RC_Group_51_RoHS_L_10.pdf; ComponentLink2Description: http://www.yageo.com/documents/recent/PYu-RC_Group_51_RoHS_L_10.pdf; ComponentLink3URL: http://www.mouser.com/ds/2/447/PYu-RC0402_51_RoHS_L_6_r-8721.pdf; ComponentLink3Description: http://www.mouser.com/ds/2/447/PYu-RC0402_51_RoHS_L_6_r-8721.pdf; ComponentLink4URL: http://www.yageo.com/documents/recent/PYu-RC0402_51_RoHS_L_6.pdf; ComponentLink4Description: http://www.yageo.com/documents/recent/PYu-RC0402_51_RoHS_L_6.pdf; ComponentLink5URL: http://www.yageo.com/documents/recent/PYu-RC0402_51_RoHS_L_6_r.pdf; ComponentLink5Description: http://www.yageo.com/documents/recent/PYu-RC0402_51_RoHS_L_6_r.pdf; Supplier 1: Digi-Key; Supplier Part Number 1: A129659CT-ND; Stock 1: 428220; Pricing 1: 1=0,10000, 10=0,02600, 100=0,01070, 1000=0,00478, 2500=0,00415, 5000=0,00343 (USD); RoHS: Yes; ComponentLink6URL: https://www.te.com/commerce/DocumentDelivery/DDEController?Action=srchrtrv&DocNm=1773204-3&DocType=DS&DocLang=English&src-supplier=Digi-Key; ComponentLink6Description: https://www.te.com/commerce/DocumentDelivery/DDEController?Action=srchrtrv&DocNm=1773204-3&DocType=DS&DocLang=English&src-supplier=Digi-Key; ComponentLink7URL: https://www.te.com/commerce/DocumentDelivery/DDEController?Action=srchrtrv&amp;DocNm=1773204-3&amp;DocType=DS&amp;DocLang=English&src-supplier=Digi-Key; ComponentLink7Description: https://www.te.com/commerce/DocumentDelivery/DDEController?Action=srchrtrv&amp;DocNm=1773204-3&amp;DocType=DS&amp;DocLang=English&src-supplier=Digi-Key; ComponentLink8URL: https://4donline.ihs.com/images/VipMasterIC/IC/TYEL/TYEL-S-A0004929575/TYEL-S-A0004929575-1.pdf?hkey=52A5661711E402568146F3353EA87419&src-supplier=Newark; ComponentLink8Description: https://4donline.ihs.com/images/VipMasterIC/IC/TYEL/TYEL-S-A0004929575/TYEL-S-A0004929575-1.pdf?hkey=52A5661711E402568146F3353EA87419&src-supplier=Newark; ComponentLink9URL: https://4donline.ihs.com/images/VipMasterIC/IC/TYEL/TYEL-S-A0004929575/TYEL-S-A0004929575-1.pdf?hkey=52A5661711E402568146F3353EA87419&src-supplier=Farnell; ComponentLink9Description: https://4donline.ihs.com/images/VipMasterIC/IC/TYEL/TYEL-S-A0004929575/TYEL-S-A0004929575-1.pdf?hkey=52A5661711E402568146F3353EA87419&src-supplier=Farnell
VT2 = NDS331N: Manufacturer: Infineon Technologies; Manufacturer Part Number 1: IRLML6244TRPBF; Part Description: N-Channel 20V 6.3A (Ta) 1.3W (Ta) Surface Mount Micro3™/SOT-23; FET Type: N-Channel; Current - Continuous Drain (Id) @ 25°C: 6.3A (Ta); Drive Voltage (Max Rds On,  Min Rds On): 2.5V, 4.5V; Vgs(th) (Max) @ Id: 1.1V @ 10µA; Gate Charge (Qg) (Max) @ Vgs: 8.9nC @ 4.5V; Input Capacitance (Ciss) (Max) @ Vds: 700pF @ 16V; Vgs (Max): ±12V; Power Dissipation (Max): 1.3W (Ta); Rds On (Max) @ Id, Vgs: 21 mOhm @ 6.3A, 4.5V; Supplier 1: Digi-Key; Supplier Part Number 1: IRLML6244TRPBFTR-ND; RoHS: RoHS Compliant; Category: Discrete Semiconductor Products; Stock 1: 21000; Pricing 1: 3000=0.09979 (USD); Packaging: Tape & Reel (TR); Part Status: Active; Technology: MOSFET (Metal Oxide); FET Feature: -; Operating Temperature: -55°C ~ 150°C (TJ); Mounting Type: Surface Mount; Supplier Device Package: Micro3™/SOT-23; Package / Case: TO-236-3, SC-59, SOT-23-3; ComponentLink1URL: https://www.infineon.com/dgdl/irlml6244pbf.pdf?fileId=5546d462533600a4015356686fed261f; ComponentLink1Description: https://www.infineon.com/dgdl/irlml6244pbf.pdf?fileId=5546d462533600a4015356686fed261f
XT1 = CRYSTAL_2PIN_RTC_RT3215: Part Description: 32.768 kHz ±10ppm Crystal 12.5pF 70 kOhms 2-SMD, No Lead; Manufacturer: Raltron Electronics; Manufacturer Part Number 1: RT3215-32.768-12.5-TR-10PPM; Supplier 1: Digi-Key; Supplier Part Number 1: 2151-RT3215-32.768-12.5-TR-10PPMTR-ND; Stock 1: 21000; Pricing 1: 3000=0,39875, 6000=0,38500, 15000=0,37125 (USD); Lead Free: Lead Free; RoHS Compliant: Yes; ComponentLink1URL: https://datasheet.octopart.com/RT3215-32.768-12.5-TR-10PPM-Raltron-Electronics-datasheet-12522443.pdf?src-supplier=Future+Electronics; ComponentLink1Description: https://datasheet.octopart.com/RT3215-32.768-12.5-TR-10PPM-Raltron-Electronics-datasheet-12522443.pdf?src-supplier=Future+Electronics; ComponentLink2URL: https://datasheet.octopart.com/RT3215-32.768-12.5-TR-10PPM-Raltron-Electronics-datasheet-62112304.pdf?src-supplier=Future+Electronics; ComponentLink2Description: https://datasheet.octopart.com/RT3215-32.768-12.5-TR-10PPM-Raltron-Electronics-datasheet-62112304.pdf?src-supplier=Future+Electronics; ComponentLink3URL: https://datasheet.octopart.com/RT3215-32.768-12.5-TR-10PPM-Raltron-Electronics-datasheet-82614827.pdf?src-supplier=Future+Electronics; ComponentLink3Description: https://datasheet.octopart.com/RT3215-32.768-12.5-TR-10PPM-Raltron-Electronics-datasheet-82614827.pdf?src-supplier=Future+Electronics